# Altium schematic sheet Main.SchDoc
size A4; SheetNumber: 1; SheetTotal: 3
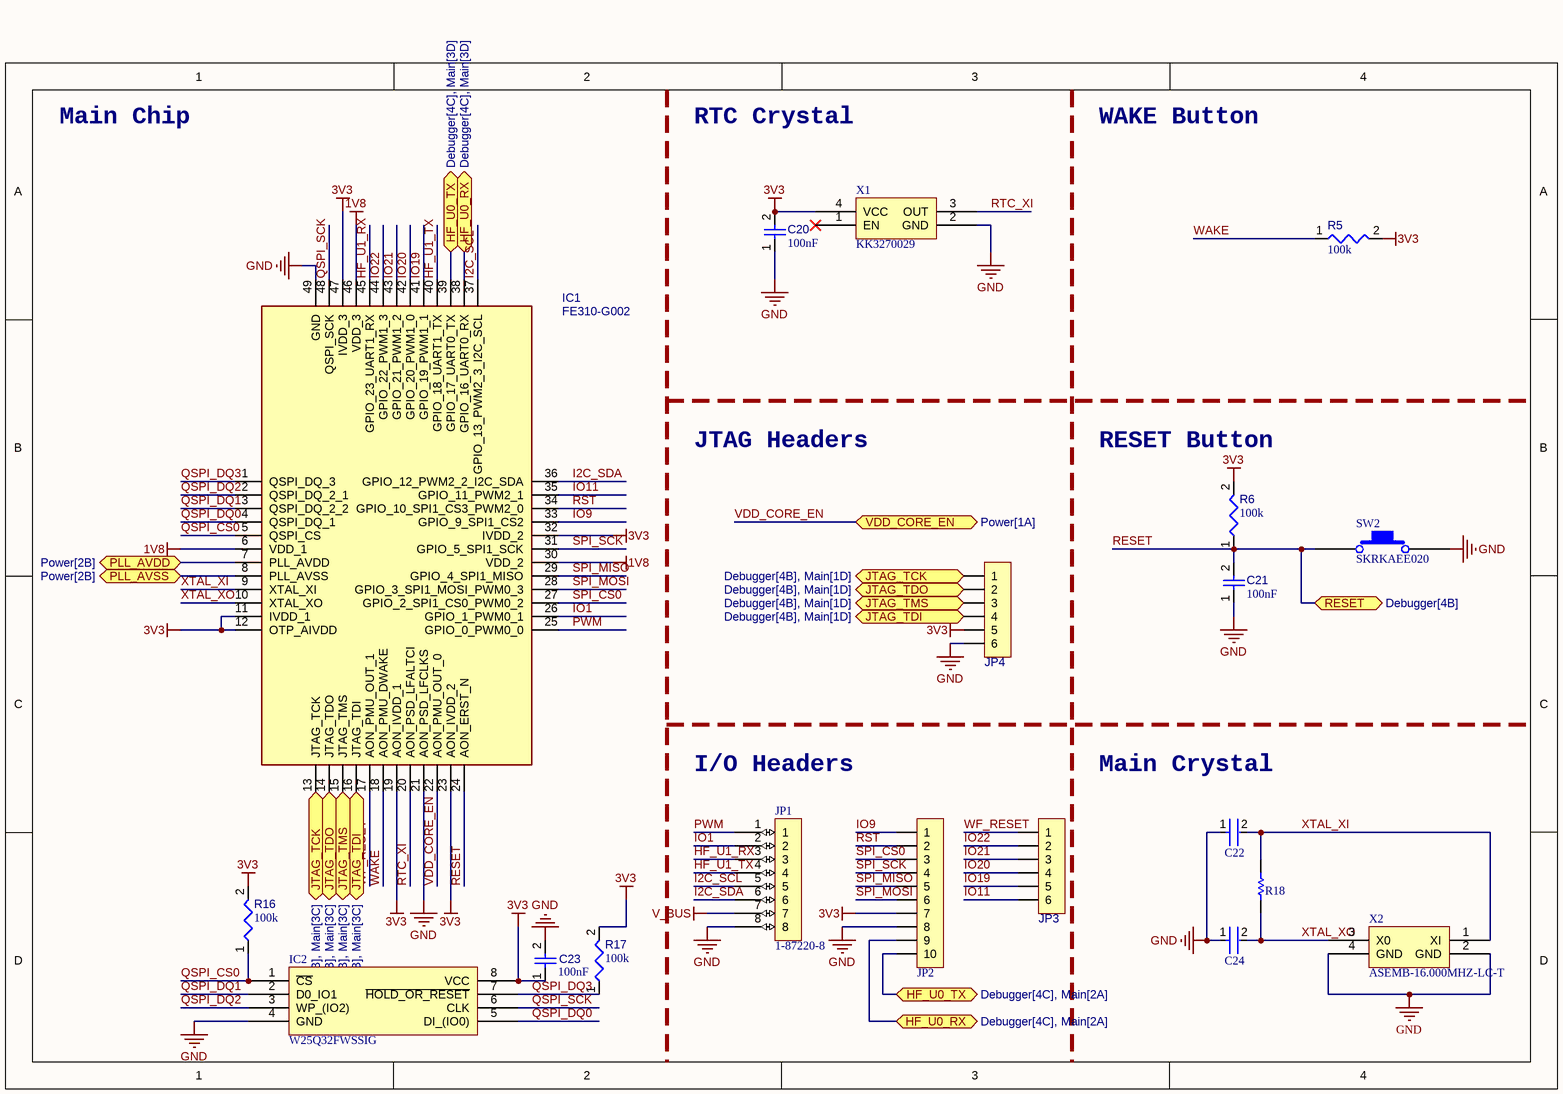
[diagram p0: Main.SchDoc]

## Parts
C20  value 100nF  [CAPC1608X90X40NL10T20]  (hidden comment: Capacitor 100 nF +/-10% 50 V 0603)
C21  value 100nF  [CAPC1608X90X40NL10T20]  (hidden comment: Capacitor 100 nF +/-10% 50 V 0603)
C22  06035A220JAT2A  [FP-0603-L_1_6_0_15-W_0_81-IPC_C]  (value not drawn)
C23  value 100nF  [CAPC1608X90X40NL10T20]  (hidden comment: Capacitor 100 nF +/-10% 50 V 0603)
C24  06035A220JAT2A  [FP-0603-L_1_6_0_15-W_0_81-IPC_C]  (value not drawn)
IC1  FE310-G002  [QFN40P600X600X93-49N]
IC2  W25Q32FWSSIG  [W25Q32FWSSIG-Footprint-1]
JP1  1-87220-8  [1-87220-8-Footprint-1]
JP2  HDR-1X10  [HDR2.54-LI-10P]  (value not drawn)
JP3  HDR-1X6  [HDR2.54-M-LI-6P]  (value not drawn)
JP4  HDR-1X6  [HDR2.54-M-LI-6P]  (value not drawn)
R5  value 100k  [RESC1608X55X25ML10T15]  (hidden comment: Resistor 100k +/-1% 0603 100 mW)
R6  value 100k  [RESC1608X55X25ML10T15]  (hidden comment: Resistor 100k +/-1% 0603 100 mW)
R16  value 100k  [RESC1608X55X25ML10T15]  (hidden comment: Resistor 100k +/-1% 0603 100 mW)
R17  value 100k  [RESC1608X55X25ML10T15]  (hidden comment: Resistor 100k +/-1% 0603 100 mW)
R18  RC0603FR-071ML  [RESC1608X55X25LL10T15]  (value not drawn)
SW2  SKRKAEE020  [RESC5020X04N]
X1  KK3270029  [KK3270029-Footprint-1]
X2  ASEMB-16.000MHZ-LC-T  [ASEMB-16.000MHZ-LC-T-Footprint-1]

## Ports
HF_U0_RX (bidir, see Debugger[4C], Main[2A]), HF_U0_RX (bidir, see Debugger[4C], Main[3D]), HF_U0_TX (bidir, see Debugger[4C], Main[2A]), HF_U0_TX (bidir, see Debugger[4C], Main[3D]), JTAG_TCK (bidir, see Debugger[4B], Main[1D]), JTAG_TCK (bidir, see Debugger[4B], Main[3C]), JTAG_TDI (bidir, see Debugger[4B], Main[1D]), JTAG_TDI (bidir, see Debugger[4B], Main[3C]), JTAG_TDO (bidir, see Debugger[4B], Main[1D]), JTAG_TDO (bidir, see Debugger[4B], Main[3C]), JTAG_TMS (bidir, see Debugger[4B], Main[1D]), JTAG_TMS (bidir, see Debugger[4B], Main[3C]), PLL_AVDD (bidir, see Power[2B]), PLL_AVSS (bidir, see Power[2B]), RESET (bidir, see Debugger[4B]), VDD_CORE_EN (bidir, see Power[1A])

## Nets
1V8: IC1.6(VDD_1) IC1.30(VDD_2) IC1.46(VDD_3)
3V3: C20.2 C23.1 IC1.11(IVDD_1) IC1.12(OTP_AIVDD) IC1.19(AON_IVDD_1) IC1.23(AON_IVDD_2) IC1.32(IVDD_2) IC1.47(IVDD_3) IC2.8(VCC) JP2.7 JP4.5 R5.2 R6.2 R16.2 R17.2 X1.4(VCC)
GND: C20.1 C21.1 C22.1 C23.2 C24.1 IC1.21(AON_PSD_LFCLKS) IC1.49(GND) IC2.4(GND) JP1.8 JP2.8 JP4.6 SW2.2 X1.2(GND) X2.2(GND) X2.4(GND)
V_BUS: JP1.7
HF_U0_RX: IC1.38(GPIO_16_UART0_RX) JP2.9 ; port HF_U0_RX
HF_U0_TX: IC1.39(GPIO_17_UART0_TX) JP2.10 ; port HF_U0_TX
HF_U1_RX: IC1.45(GPIO_23_UART1_RX) JP1.3
HF_U1_TX: IC1.40(GPIO_18_UART1_TX) JP1.4
I2C_SCL: IC1.37(GPIO_13_PWM2_3_I2C_SCL) JP1.5
I2C_SDA: IC1.36(GPIO_12_PWM2_2_I2C_SDA) JP1.6
IO1: IC1.26(GPIO_1_PWM0_1) JP1.2
IO9: IC1.33(GPIO_9_SPI1_CS2) JP2.1
IO11: IC1.35(GPIO_11_PWM2_1) JP3.6
IO19: IC1.41(GPIO_19_PWM1_1) JP3.5
IO20: IC1.42(GPIO_20_PWM1_0) JP3.4
IO21: IC1.43(GPIO_21_PWM1_2) JP3.3
IO22: IC1.44(GPIO_22_PWM1_3) JP3.2
JTAG_TCK: IC1.13(JTAG_TCK) JP4.1 ; port JTAG_TCK
JTAG_TDI: IC1.16(JTAG_TDI) JP4.4 ; port JTAG_TDI
JTAG_TDO: IC1.14(JTAG_TDO) JP4.2 ; port JTAG_TDO
JTAG_TMS: IC1.15(JTAG_TMS) JP4.3 ; port JTAG_TMS
PLL_AVDD: IC1.7(PLL_AVDD) ; port PLL_AVDD
PLL_AVSS: IC1.8(PLL_AVSS) ; port PLL_AVSS
PWM: IC1.25(GPIO_0_PWM0_0) JP1.1
QSPI_CS0: IC1.5(QSPI_CS) IC2.1(~{CS}) R16.1
QSPI_DQ0: IC1.4(QSPI_DQ_1) IC2.5(DI_(IO0))
QSPI_DQ1: IC1.3(QSPI_DQ_2_2) IC2.2(D0_IO1)
QSPI_DQ2: IC1.2(QSPI_DQ_2_1) IC2.3(WP_(IO2))
QSPI_DQ3: IC1.1(QSPI_DQ_3) IC2.7(~{HOLD_OR_RESET}) R17.1
QSPI_SCK: IC1.48(QSPI_SCK) IC2.6(CLK)
RESET: C21.2 IC1.24(AON_ERST_N) R6.1 SW2.1 ; port RESET
RST: IC1.34(GPIO_10_SPI1_CS3_PWM2_0) JP2.2
RTC_XI: IC1.20(AON_PSD_LFALTCI) X1.3(OUT)
SPI_CS0: IC1.27(GPIO_2_SPI1_CS0_PWM0_2) JP2.3
SPI_MISO: IC1.29(GPIO_4_SPI1_MISO) JP2.5
SPI_MOSI: IC1.28(GPIO_3_SPI1_MOSI_PWM0_3) JP2.6
SPI_SCK: IC1.31(GPIO_5_SPI1_SCK) JP2.4
VDD_CORE_EN: IC1.22(AON_PMU_OUT_0) ; port VDD_CORE_EN
WAKE: IC1.18(AON_PMU_DWAKE) R5.1
WF_RESET: IC1.17(AON_PMU_OUT_1) JP3.1
XTAL_XI: C22.2 IC1.9(XTAL_XI) R18.2 X2.1(XI)
XTAL_XO: C24.2 IC1.10(XTAL_XO) R18.1 X2.3(X0)

Not connected (* = marked no-connect by the designer): X1 1(EN)*

## Notes on the sheet
- Main Chip
- RTC Crystal
- WAKE Button
- JTAG Headers
- (near R6) RESET Button
- I/O Headers
- Main Crystal

## Library data of the parts
C20 C21 C23 = CMP-001-00017-6: Chip Capacitor, 100 nF, +/- 10%, 50 V, 0603 (1608 Metric); Voltage Rating: 50V; Capacitor Type: Ceramic; Tolerance: 10%; Mounting Technology: SM; Max Operating Temperature: 125°C; RoHS Compliant: True; Pins: 2; Case/Package: 0603; Min Operating Temperature: -55°C
C22 C24 = CMP-001-00085-1: 0603 22 pF 50V ±5% Tolerance C0G/NP0 Surface Mount Multilayer Ceramic Capacitor
IC1 = FE310-G002: Integrated Circuit; Manufacturer_Name: SiFive; Datasheet Link: https://sifive.cdn.prismic.io/sifive%2F3d777659-a0dd-49ed-a011-5bebba17aecf_fe310-g002-ds.pdf; Height: 0.93mm; Manufacturer_Part_Number: FE310-G002
IC2 = CMP-001-0001-2: IC Flash 32M Spi 104MHZ 8SOIC / 1.8V 32M-BIT Serial Flash Memory With Dual/quad Spi & Qpi
JP1 = CMP-002-00072-1: Conn Unshrouded Header HDR 1x8 POS 2.54mm Solder ST Thru-Hole Carton
JP2 = Header 10: 10P接插件; 版权归属: 淘宝ID:黄晶宝石; BOM名称: 10P接插件; 学习资源: https://shop463601444.taobao.com
JP3 JP4 = Header 6: 6P接插件; 联系卖家，免费查找封装: 唯一出售店铺网址https://shop463601444.taobao.com; 封装库来自淘宝卖家ID:黄晶宝石: 其他店铺购入均为盗版假冒封装库，请立即申请退款，本店现金奖励20~200元; BOM名称: 6P接插件
R5 R6 R16 R17 = CMP-009-00023-5: Chip Resistor, 100 KOhm, +/- 1%, 0.1 W, -55 to 155 degC, 0603 (1608 Metric); Voltage Rating: 50V; Power: 100mW; Max Operating Temperature: 155°C; RoHS Compliant: True; Tolerance: 1%; Pins: 2; Case/Package: 0603; Mounting Technology: SM; Min Operating Temperature: -55°C
R18 = CMP-009-00177-1: Res Thick Film 0603 1M Ohm 1% 1/10W ±100ppm/°C Molded SMD Paper T/R
SW2 = CMP-011-00014-1: Switch Tactile N.O. SPST Round Button Gull Wing 0.05A 12VDC 1.57N SMD T/R
X1 = CMP-023-00000-1: Xtal Osc Xo 32.7680KHZ Cmos SMD
X2 = CMP-023-00001-1: Oscillator MEMS 16MHz ±50ppm (Stability) 15pF LVCMOS 55% 1.8V/2.5V/3.3V Automotive 4-Pin QFN SMD T/R